# Altium project Artix Express UltraScale v2_2023-02-28T07_25_07_UTC.PrjPcb (part 1 of 7)
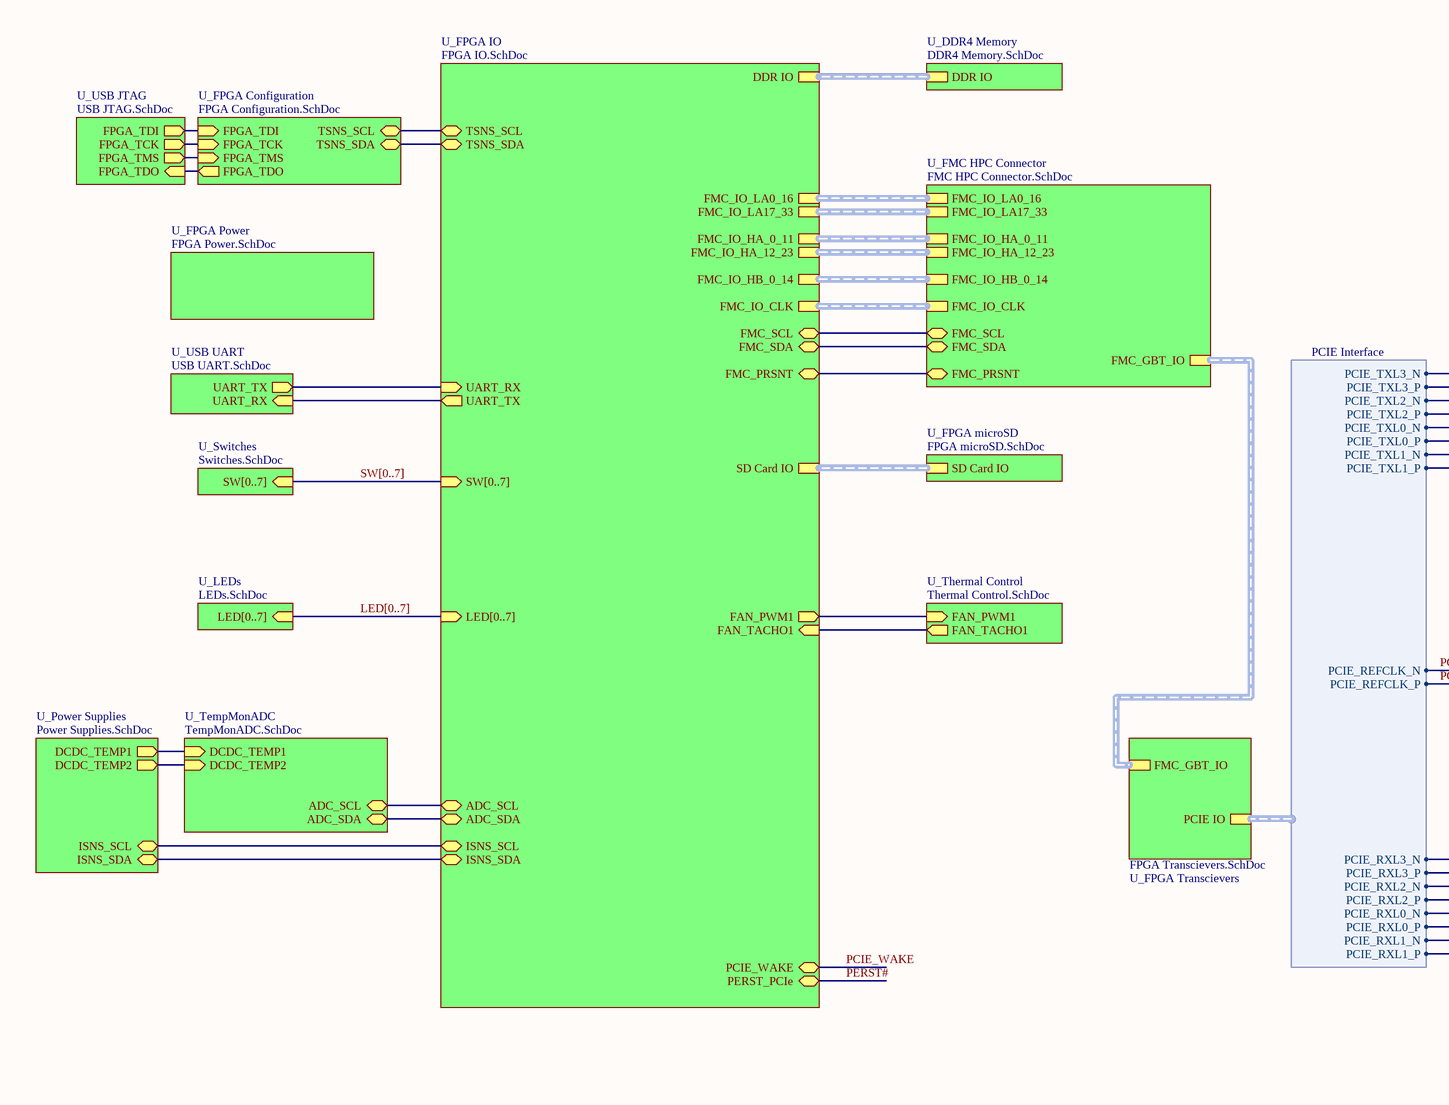
[diagram p0: TopSheet.SchDoc, left]
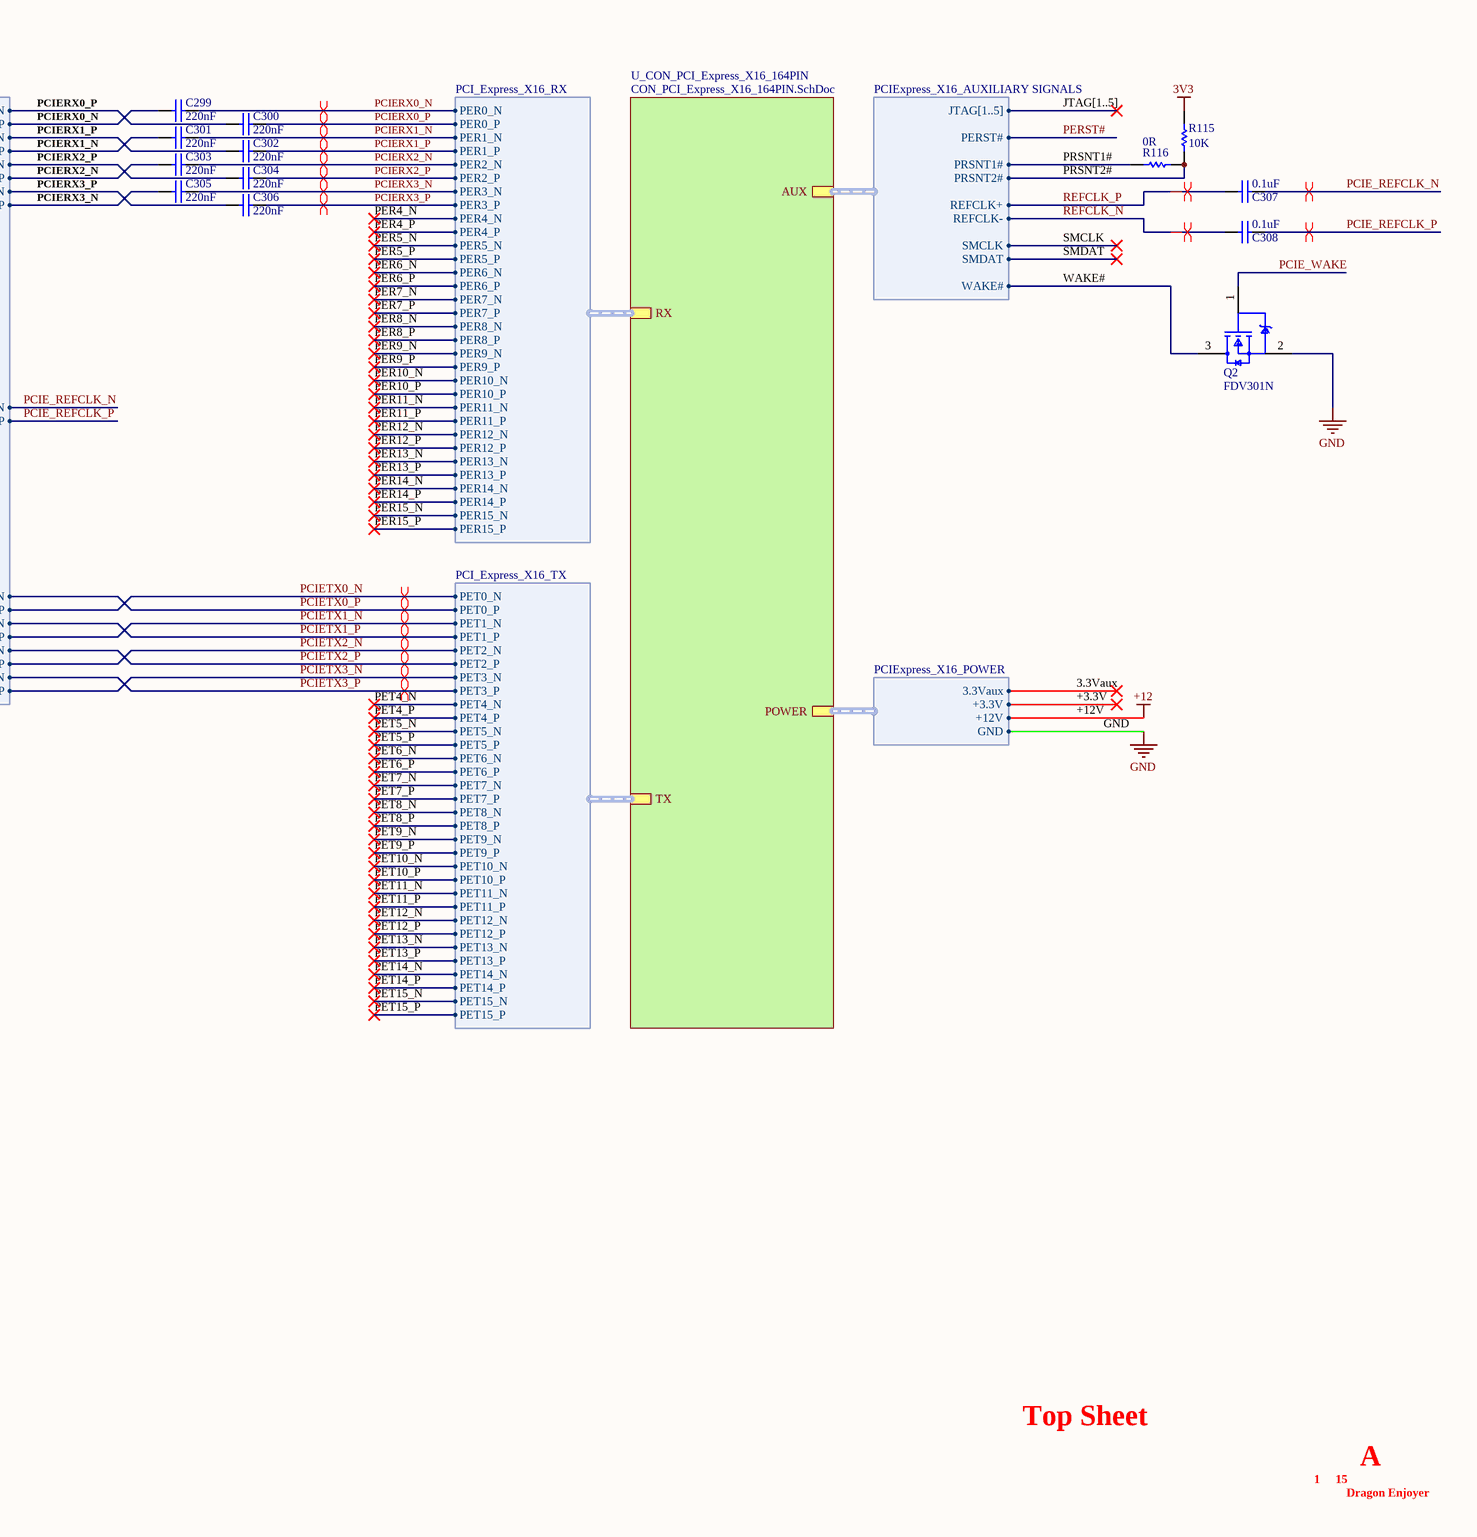
[diagram p1: TopSheet.SchDoc, right]
ProjectAddress1: IBP Shanghai; ProjectAddress2: Level 3 - Building 3; ProjectAddress3: No.168 Linhong Road; ProjectAddress4: Shanghai 200335, China; ProjectOrganization: Altium; ProjectTitle: PCI Express x16 Recommended Length card; Template Family: PCI Express; Template Notes: - Nominal values used, dimensions in mm  - The mounting holes and keep-out areas around them are only required when the I/O bracket is mounted on the card directly  - Component height rule and clearance rule derived from PCI_Express_CEM_r2.0.pdf, Page 84.  - Stackup is not specified in PCI_Express_CEM_r2.0.pdf, nor implemented in this template.; Template Revision Date: Oct 29, 2010; Template Source Document: Outline:PCI_Express_CEM_r2.0.pdf  Pinout:PCI_Express_CEM_r2.0.pdf; Template Source Organization: PCI-SIG; Template Source Revision Date: R2.0, April 11, 2007; Template Source URL: http://www.pcisig.com/
15 sheets, 420 parts. Net scope: hierarchical (ports join the sheet entries above them; power ports are global).
Board file: PCI Express_24130X11115_164PIN.PCBDOC
Sheets:
  TopSheet.SchDoc
    U_DDR4 Memory = DDR4 Memory.SchDoc
    U_FMC HPC Connector = FMC HPC Connector.SchDoc
    U_FPGA Configuration = FPGA Configuration.SchDoc
    U_FPGA IO = FPGA IO.SchDoc
    U_FPGA microSD = FPGA microSD.SchDoc
    U_FPGA Power = FPGA Power.SchDoc
    U_FPGA Transcievers = FPGA Transcievers.SchDoc
    U_LEDs = LEDs.SchDoc
    U_Power Supplies = Power Supplies.SchDoc
    U_Switches = Switches.SchDoc
    U_TempMonADC = TempMonADC.SchDoc
    U_Thermal Control = Thermal Control.SchDoc
    U_USB JTAG = USB JTAG.SchDoc
    U_USB UART = USB UART.SchDoc

## Sheet TopSheet.SchDoc
size A2; SheetNumber: 1; SheetTotal: 16

### Parts
C299  value 220nF  [CAPC1005X56X25LL10T15]  (hidden comment: 04026D224MAT2A)
C300  value 220nF  [CAPC1005X56X25LL10T15]  (hidden comment: 04026D224MAT2A)
C301  value 220nF  [CAPC1005X56X25LL10T15]  (hidden comment: 04026D224MAT2A)
C302  value 220nF  [CAPC1005X56X25LL10T15]  (hidden comment: 04026D224MAT2A)
C303  value 220nF  [CAPC1005X56X25LL10T15]  (hidden comment: 04026D224MAT2A)
C304  value 220nF  [CAPC1005X56X25LL10T15]  (hidden comment: 04026D224MAT2A)
C305  value 220nF  [CAPC1005X56X25LL10T15]  (hidden comment: 04026D224MAT2A)
C306  value 220nF  [CAPC1005X56X25LL10T15]  (hidden comment: 04026D224MAT2A)
C307  value 0.1uF  [CAPC1005X56X25LL10T15]  (hidden comment: 04026D104KAT2A)
C308  value 0.1uF  [CAPC1005X56X25LL10T15]  (hidden comment: 04026D104KAT2A)
Q2  FDV301N  [FP-318-08-MFG]
R115  value 10K  [RESC1609X50X30NL8T20]  (hidden comment: CRCW060310K0FKEA)
R116  value 0R  [RESC1005X40X25ML05T10]  (hidden comment: CRCW04020000Z0EDHP)

### Sub-sheets
U_CON_PCI_Express_X16_164PIN = CON_PCI_Express_X16_164PIN.SchDoc (file not in this document): POWER (harness PCIExpress_X16_POWER), AUX (harness PCIExpress_X16_AUXILIARY SIGNALS), TX (harness PCI_Express_X16_TX), RX (harness PCI_Express_X16_RX)
U_DDR4 Memory = DDR4 Memory.SchDoc: DDR IO (harness DDR IO)
U_FMC HPC Connector = FMC HPC Connector.SchDoc: FMC_GBT_IO (harness FMC_GBT_IO), FMC_IO_LA0_16 (harness FMC_IO_LA0_16), FMC_IO_LA17_33 (harness FMC_IO_LA17_33), FMC_IO_HA_0_11 (harness FMC_IO_HA_0_11), FMC_IO_HA_12_23 (harness FMC_IO_HA_12_23), FMC_SCL (bidir), FMC_SDA (bidir), FMC_PRSNT (bidir), FMC_IO_CLK (harness FMC_IO_CLK), FMC_IO_HB_0_14 (harness FMC_IO_HB_0_14)
U_FPGA Configuration = FPGA Configuration.SchDoc: FPGA_TDI (in), FPGA_TDO (out), FPGA_TCK (in), FPGA_TMS (in), TSNS_SCL (bidir), TSNS_SDA (bidir)
U_FPGA IO = FPGA IO.SchDoc: DDR IO (harness DDR IO), PERST_PCIe (bidir), ISNS_SCL (bidir), ISNS_SDA (bidir), TSNS_SCL (bidir), TSNS_SDA (bidir), FMC_IO_LA0_16 (harness FMC_IO_LA0_16), FMC_IO_LA17_33 (harness FMC_IO_LA17_33), FMC_IO_HA_0_11 (harness FMC_IO_HA_0_11), FMC_IO_HA_12_23 (harness FMC_IO_HA_12_23), FMC_IO_CLK (harness FMC_IO_CLK), UART_TX (out), UART_RX (in), FMC_SCL (bidir), FMC_SDA (bidir), FMC_IO_HB_0_14 (harness FMC_IO_HB_0_14), SD Card IO (harness SD Card IO), LED[0..7] (in), SW[0..7] (in), ADC_SDA (bidir), ADC_SCL (bidir), FMC_PRSNT (bidir), FAN_TACHO1 (in), FAN_PWM1 (out), PCIE_WAKE (bidir)
U_FPGA microSD = FPGA microSD.SchDoc: SD Card IO (harness SD Card IO)
U_FPGA Power = FPGA Power.SchDoc: no entries
U_FPGA Transcievers = FPGA Transcievers.SchDoc: PCIE IO (harness PCIE Interface), FMC_GBT_IO (harness FMC_GBT_IO)
U_LEDs = LEDs.SchDoc: LED[0..7] (in)
U_Power Supplies = Power Supplies.SchDoc: DCDC_TEMP1 (out), DCDC_TEMP2 (out), ISNS_SCL (bidir), ISNS_SDA (bidir)
U_Switches = Switches.SchDoc: SW[0..7] (in)
U_TempMonADC = TempMonADC.SchDoc: DCDC_TEMP1 (in), DCDC_TEMP2 (in), ADC_SDA (bidir), ADC_SCL (bidir)
U_Thermal Control = Thermal Control.SchDoc: FAN_TACHO1 (out), FAN_PWM1 (in)
U_USB JTAG = USB JTAG.SchDoc: FPGA_TDI (out), FPGA_TDO (in), FPGA_TCK (out), FPGA_TMS (out)
U_USB UART = USB UART.SchDoc: UART_TX (out), UART_RX (in)

### Harnesses
PCIE Interface: PCIE_REFCLK_N, PCIE_REFCLK_P, PCIE_RXL0_N, PCIE_RXL0_P, PCIE_RXL1_N, PCIE_RXL1_P, PCIE_RXL2_N, PCIE_RXL2_P, PCIE_RXL3_N, PCIE_RXL3_P, PCIE_TXL0_N, PCIE_TXL0_P, PCIE_TXL1_N, PCIE_TXL1_P, PCIE_TXL2_N, PCIE_TXL2_P, PCIE_TXL3_N, PCIE_TXL3_P
PCI_Express_X16_RX: PER0_N, PER0_P, PER1_N, PER1_P, PER2_N, PER2_P, PER3_N, PER3_P, PER4_N, PER4_P, PER5_N, PER5_P, PER6_N, PER6_P, PER7_N, PER7_P, PER8_N, PER8_P, PER9_N, PER9_P, PER10_N, PER10_P, PER11_N, PER11_P, PER12_N, PER12_P, PER13_N, PER13_P, PER14_N, PER14_P, PER15_N, PER15_P
PCI_Express_X16_TX: PET0_N, PET0_P, PET1_N, PET1_P, PET2_N, PET2_P, PET3_N, PET3_P, PET4_N, PET4_P, PET5_N, PET5_P, PET6_N, PET6_P, PET7_N, PET7_P, PET8_N, PET8_P, PET9_N, PET9_P, PET10_N, PET10_P, PET11_N, PET11_P, PET12_N, PET12_P, PET13_N, PET13_P, PET14_N, PET14_P, PET15_N, PET15_P
PCIExpress_X16_POWER: +3.3V, +12V, GND, 3.3Vaux
PCIExpress_X16_AUXILIARY SIGNALS: JTAG[1..5], PERST#, PRSNT1#, PRSNT2#, REFCLK+, REFCLK-, SMCLK, SMDAT, WAKE#

### Nets
3V3: R115.2  [project net +3V3]
GND: Q2.2(S) ; sheet U_CON_PCI_Express_X16_164PIN/POWER.GND
3.3Vaux: sheet U_CON_PCI_Express_X16_164PIN/POWER.3.3Vaux
+3.3V: sheet U_CON_PCI_Express_X16_164PIN/POWER.+3.3V
FMC_PRSNT: sheet U_FMC HPC Connector/FMC_PRSNT, sheet U_FPGA IO/FMC_PRSNT
FMC_SCL: sheet U_FMC HPC Connector/FMC_SCL, sheet U_FPGA IO/FMC_SCL
FMC_SDA: sheet U_FMC HPC Connector/FMC_SDA, sheet U_FPGA IO/FMC_SDA
FPGA_TCK: sheet U_FPGA Configuration/FPGA_TCK, sheet U_USB JTAG/FPGA_TCK
FPGA_TDI: sheet U_FPGA Configuration/FPGA_TDI, sheet U_USB JTAG/FPGA_TDI
FPGA_TDO: sheet U_FPGA Configuration/FPGA_TDO, sheet U_USB JTAG/FPGA_TDO
FPGA_TMS: sheet U_FPGA Configuration/FPGA_TMS, sheet U_USB JTAG/FPGA_TMS
ISNS_SCL: sheet U_FPGA IO/ISNS_SCL, sheet U_Power Supplies/ISNS_SCL
ISNS_SDA: sheet U_FPGA IO/ISNS_SDA, sheet U_Power Supplies/ISNS_SDA
PCIE_REFCLK_N: C307.2 ; sheet U_FPGA Transcievers/PCIE IO.PCIE_REFCLK_N
PCIE_REFCLK_P: C308.2 ; sheet U_FPGA Transcievers/PCIE IO.PCIE_REFCLK_P
PCIE_TXL0_N: C304.1 ; sheet U_FPGA Transcievers/PCIE IO.PCIE_TXL0_N
PCIE_TXL0_P: C303.1 ; sheet U_FPGA Transcievers/PCIE IO.PCIE_TXL0_P
PCIE_TXL1_N: C306.1 ; sheet U_FPGA Transcievers/PCIE IO.PCIE_TXL1_N
PCIE_TXL1_P: C305.1 ; sheet U_FPGA Transcievers/PCIE IO.PCIE_TXL1_P
PCIE_TXL2_N: C302.1 ; sheet U_FPGA Transcievers/PCIE IO.PCIE_TXL2_N
PCIE_TXL2_P: C301.1 ; sheet U_FPGA Transcievers/PCIE IO.PCIE_TXL2_P
PCIE_TXL3_N: C300.1 ; sheet U_FPGA Transcievers/PCIE IO.PCIE_TXL3_N
PCIE_TXL3_P: C299.1 ; sheet U_FPGA Transcievers/PCIE IO.PCIE_TXL3_P
PCIE_WAKE: Q2.1(G) ; sheet U_FPGA IO/PCIE_WAKE
PCIERX0_N: C299.2 ; sheet U_CON_PCI_Express_X16_164PIN/RX.PER0_N
PCIERX0_P: C300.2 ; sheet U_CON_PCI_Express_X16_164PIN/RX.PER0_P
PCIERX1_N: C301.2 ; sheet U_CON_PCI_Express_X16_164PIN/RX.PER1_N
PCIERX1_P: C302.2 ; sheet U_CON_PCI_Express_X16_164PIN/RX.PER1_P
PCIERX2_N: C303.2 ; sheet U_CON_PCI_Express_X16_164PIN/RX.PER2_N
PCIERX2_P: C304.2 ; sheet U_CON_PCI_Express_X16_164PIN/RX.PER2_P
PCIERX3_N: C305.2 ; sheet U_CON_PCI_Express_X16_164PIN/RX.PER3_N
PCIERX3_P: C306.2 ; sheet U_CON_PCI_Express_X16_164PIN/RX.PER3_P
PCIETX0_N: sheet U_FPGA Transcievers/PCIE IO.PCIE_RXL3_P, sheet U_CON_PCI_Express_X16_164PIN/TX.PET0_N  [project net PCIE_RXL3_P]
PCIETX0_P: sheet U_FPGA Transcievers/PCIE IO.PCIE_RXL3_N, sheet U_CON_PCI_Express_X16_164PIN/TX.PET0_P  [project net PCIE_RXL3_N]
PCIETX1_N: sheet U_FPGA Transcievers/PCIE IO.PCIE_RXL2_P, sheet U_CON_PCI_Express_X16_164PIN/TX.PET1_N  [project net PCIE_RXL2_P]
PCIETX1_P: sheet U_FPGA Transcievers/PCIE IO.PCIE_RXL2_N, sheet U_CON_PCI_Express_X16_164PIN/TX.PET1_P  [project net PCIE_RXL2_N]
PCIETX2_N: sheet U_FPGA Transcievers/PCIE IO.PCIE_RXL0_P, sheet U_CON_PCI_Express_X16_164PIN/TX.PET2_N  [project net PCIE_RXL0_P]
PCIETX2_P: sheet U_FPGA Transcievers/PCIE IO.PCIE_RXL0_N, sheet U_CON_PCI_Express_X16_164PIN/TX.PET2_P  [project net PCIE_RXL0_N]
PCIETX3_N: sheet U_FPGA Transcievers/PCIE IO.PCIE_RXL1_P, sheet U_CON_PCI_Express_X16_164PIN/TX.PET3_N  [project net PCIE_RXL1_P]
PCIETX3_P: sheet U_FPGA Transcievers/PCIE IO.PCIE_RXL1_N, sheet U_CON_PCI_Express_X16_164PIN/TX.PET3_P  [project net PCIE_RXL1_N]
PER4_N: sheet U_CON_PCI_Express_X16_164PIN/RX.PER4_N
PER4_P: sheet U_CON_PCI_Express_X16_164PIN/RX.PER4_P
PER5_N: sheet U_CON_PCI_Express_X16_164PIN/RX.PER5_N
PER5_P: sheet U_CON_PCI_Express_X16_164PIN/RX.PER5_P
PER6_N: sheet U_CON_PCI_Express_X16_164PIN/RX.PER6_N
PER6_P: sheet U_CON_PCI_Express_X16_164PIN/RX.PER6_P
PER7_N: sheet U_CON_PCI_Express_X16_164PIN/RX.PER7_N
PER7_P: sheet U_CON_PCI_Express_X16_164PIN/RX.PER7_P
PER8_N: sheet U_CON_PCI_Express_X16_164PIN/RX.PER8_N
PER8_P: sheet U_CON_PCI_Express_X16_164PIN/RX.PER8_P
PER9_N: sheet U_CON_PCI_Express_X16_164PIN/RX.PER9_N
PER9_P: sheet U_CON_PCI_Express_X16_164PIN/RX.PER9_P
PER10_N: sheet U_CON_PCI_Express_X16_164PIN/RX.PER10_N
PER10_P: sheet U_CON_PCI_Express_X16_164PIN/RX.PER10_P
PER11_N: sheet U_CON_PCI_Express_X16_164PIN/RX.PER11_N
PER11_P: sheet U_CON_PCI_Express_X16_164PIN/RX.PER11_P
PER12_N: sheet U_CON_PCI_Express_X16_164PIN/RX.PER12_N
PER12_P: sheet U_CON_PCI_Express_X16_164PIN/RX.PER12_P
PER13_N: sheet U_CON_PCI_Express_X16_164PIN/RX.PER13_N
PER13_P: sheet U_CON_PCI_Express_X16_164PIN/RX.PER13_P
PER14_N: sheet U_CON_PCI_Express_X16_164PIN/RX.PER14_N
PER14_P: sheet U_CON_PCI_Express_X16_164PIN/RX.PER14_P
PER15_N: sheet U_CON_PCI_Express_X16_164PIN/RX.PER15_N
PER15_P: sheet U_CON_PCI_Express_X16_164PIN/RX.PER15_P
PERST#: sheet U_FPGA IO/PERST_PCIe, sheet U_CON_PCI_Express_X16_164PIN/AUX.PERST#
PET4_N: sheet U_CON_PCI_Express_X16_164PIN/TX.PET4_N
PET4_P: sheet U_CON_PCI_Express_X16_164PIN/TX.PET4_P
PET5_N: sheet U_CON_PCI_Express_X16_164PIN/TX.PET5_N
PET5_P: sheet U_CON_PCI_Express_X16_164PIN/TX.PET5_P
PET6_N: sheet U_CON_PCI_Express_X16_164PIN/TX.PET6_N
PET6_P: sheet U_CON_PCI_Express_X16_164PIN/TX.PET6_P
PET7_N: sheet U_CON_PCI_Express_X16_164PIN/TX.PET7_N
PET7_P: sheet U_CON_PCI_Express_X16_164PIN/TX.PET7_P
PET8_N: sheet U_CON_PCI_Express_X16_164PIN/TX.PET8_N
PET8_P: sheet U_CON_PCI_Express_X16_164PIN/TX.PET8_P
PET9_N: sheet U_CON_PCI_Express_X16_164PIN/TX.PET9_N
PET9_P: sheet U_CON_PCI_Express_X16_164PIN/TX.PET9_P
PET10_N: sheet U_CON_PCI_Express_X16_164PIN/TX.PET10_N
PET10_P: sheet U_CON_PCI_Express_X16_164PIN/TX.PET10_P
PET11_N: sheet U_CON_PCI_Express_X16_164PIN/TX.PET11_N
PET11_P: sheet U_CON_PCI_Express_X16_164PIN/TX.PET11_P
PET12_N: sheet U_CON_PCI_Express_X16_164PIN/TX.PET12_N
PET12_P: sheet U_CON_PCI_Express_X16_164PIN/TX.PET12_P
PET13_N: sheet U_CON_PCI_Express_X16_164PIN/TX.PET13_N
PET13_P: sheet U_CON_PCI_Express_X16_164PIN/TX.PET13_P
PET14_N: sheet U_CON_PCI_Express_X16_164PIN/TX.PET14_N
PET14_P: sheet U_CON_PCI_Express_X16_164PIN/TX.PET14_P
PET15_N: sheet U_CON_PCI_Express_X16_164PIN/TX.PET15_N
PET15_P: sheet U_CON_PCI_Express_X16_164PIN/TX.PET15_P
PRSNT1#: R116.1 ; sheet U_CON_PCI_Express_X16_164PIN/AUX.PRSNT1#
PRSNT2#: R115.1 R116.2 ; sheet U_CON_PCI_Express_X16_164PIN/AUX.PRSNT2#
REFCLK_N: C308.1 ; sheet U_CON_PCI_Express_X16_164PIN/AUX.REFCLK-
REFCLK_P: C307.1 ; sheet U_CON_PCI_Express_X16_164PIN/AUX.REFCLK+
SMCLK: sheet U_CON_PCI_Express_X16_164PIN/AUX.SMCLK
SMDAT: sheet U_CON_PCI_Express_X16_164PIN/AUX.SMDAT
TSNS_SCL: sheet U_FPGA Configuration/TSNS_SCL, sheet U_FPGA IO/TSNS_SCL
TSNS_SDA: sheet U_FPGA Configuration/TSNS_SDA, sheet U_FPGA IO/TSNS_SDA
UART_RX: sheet U_FPGA IO/UART_TX, sheet U_USB UART/UART_RX
UART_TX: sheet U_FPGA IO/UART_RX, sheet U_USB UART/UART_TX
WAKE#: Q2.3(D) ; sheet U_CON_PCI_Express_X16_164PIN/AUX.WAKE#
NetR83_2: sheet U_FPGA IO/ADC_SDA, sheet U_TempMonADC/ADC_SDA
NetR84_2: sheet U_FPGA IO/ADC_SCL, sheet U_TempMonADC/ADC_SCL
NetU1_F3: sheet U_Power Supplies/DCDC_TEMP2, sheet U_TempMonADC/DCDC_TEMP2
NetU2_F3: sheet U_Power Supplies/DCDC_TEMP1, sheet U_TempMonADC/DCDC_TEMP1
NetU12_W12: sheet U_FPGA IO/FAN_TACHO1, sheet U_Thermal Control/FAN_TACHO1
NetU12_W13: sheet U_FPGA IO/FAN_PWM1, sheet U_Thermal Control/FAN_PWM1

### Buses and harness runs
bus JTAG[1..5]
bus LED[0..7] = sheet U_FPGA IO/LED[0..7] = sheet U_LEDs/LED[0..7]
bus SW[0..7] = sheet U_FPGA IO/SW[0..7] = sheet U_Switches/SW[0..7]
harness sheet U_DDR4 Memory/DDR IO = sheet U_FPGA IO/DDR IO
harness sheet U_FMC HPC Connector/FMC_GBT_IO = sheet U_FPGA Transcievers/FMC_GBT_IO
harness sheet U_FMC HPC Connector/FMC_IO_CLK = sheet U_FPGA IO/FMC_IO_CLK
harness sheet U_FMC HPC Connector/FMC_IO_HA_0_11 = sheet U_FPGA IO/FMC_IO_HA_0_11
harness sheet U_FMC HPC Connector/FMC_IO_HA_12_23 = sheet U_FPGA IO/FMC_IO_HA_12_23
harness sheet U_FMC HPC Connector/FMC_IO_HB_0_14 = sheet U_FPGA IO/FMC_IO_HB_0_14
harness sheet U_FMC HPC Connector/FMC_IO_LA0_16 = sheet U_FPGA IO/FMC_IO_LA0_16
harness sheet U_FMC HPC Connector/FMC_IO_LA17_33 = sheet U_FPGA IO/FMC_IO_LA17_33
harness sheet U_FPGA IO/SD Card IO = sheet U_FPGA microSD/SD Card IO

### Layout directives
differential pair: PCIE_REFCLK_N, PCIE_REFCLK_P, PCIE_RXL0_N, PCIE_RXL0_P, PCIE_RXL1_N, PCIE_RXL1_P, PCIE_RXL2_N, PCIE_RXL2_P, PCIE_RXL3_N, PCIE_RXL3_P, PCIERX0_N, PCIERX0_P, PCIERX1_N, PCIERX1_P, PCIERX2_N, PCIERX2_P, PCIERX3_N, PCIERX3_P, REFCLK_N, REFCLK_P

### Notes on the sheet
- PCIERX0_N
- PCIERX0_P
- PCIERX1_N
- PCIERX1_P
- PCIERX2_N
- PCIERX2_P
- PCIERX3_N
- PCIERX3_P
- Top Sheet
- 1
- 15
- Dragon Enjoyer
- A

### Library data of the parts
C299-C306 = CMP-2008-02749-1: Manufacturer: AVX Interconnect / Elco; Part Number: 04026D224MAT2A
C307 C308 = CMP-2008-02743-1: Manufacturer: AVX Interconnect / Elco; Part Number: 04026D104KAT2A
Q2 = CMP-2000-04935-2: MOSFET N-CH 25V 220MA SOT-23; Manufacturer: ON Semiconductor; Turn Off Delay Time: 3.5ns; Typ Forward Diode Voltage: 0.8V; Max Junction Temp: +150°C; Threshold Vgs Max: 1.06V; Threshold Vgs Min: 0.7V; Standoff Height: 0.01mm; Max Forward Diode Voltage: 1.2V; Number Of Channels: 1; Rthja Max: 357°C/W; Drain To Source Resistance: 3.1Ω; Input Capacitace At Vds: 9.5pF @ 10V; Gate Charge At Vgs: 0.49nC @ 4.5V; Transconductance: 0.2S; Turn On Delay Time: 3.2ns; Depletion Mode: False; Power Dissipation: 0.35W; Continuous Drain Current: 0.22A; Gate To Source Voltage: 8V; RoHS: TRUE; Lead Free: Yes; Temperature Range High: +150°C; Automotive: No; Height: 1.11mm; Category: Trans; Mouser Description: MOSFET N-Ch Digital; Drain To Source Voltage: 25V; Temperature: -55°C to +150°C; Ipc Land Pattern Name: SOT95P240X100-3; Device Class L1: Discrete Semiconductors; Octopart: https://octopart.com/fdv301n-on+semiconductor-84326713; Footprint Url: https://www.onsemi.com/pub/Collateral/318-08.PDF; Digikey Description: MOSFET N-CH 25V 220MA SOT-23; Drain To Source Breakdown Voltage: 25V; Temperature Range Low: -55°C; Number Of N Channels: 1; Device Class L3: MOSFETs; Package: 318-08; ComponentLink2URL: https://www.onsemi.com/pub/Collateral/FDV301N-D.PDF; Manufacturer Part Number: FDV301N; Device Class L2: Transistors; ComponentLink2Description: Datasheet
R115 = CMP-1666-00005-4: Chip Resistor, 10 KOhm, +/- 1%, 100 mW, -55 to 155 degC, 0603 (1608 Metric), RoHS, Tape and Reel; Manufacturer: Vishay Semiconductor; Voltage Rating: 75 V; Max Operating Temperature: 155 degC; PackageDescription: 2-Pin Surface Mount Device, Body 1.575 x 0.85 mm; ComponentLink1Description: Manufacturer URL; RoHSCompliant: true; PackageReference: 0603; REACH SVHC: Unknown; Length: 1.55 mm; DatasheetVersion: 06/2012; Packaging: Tape and Reel; Min Operating Temperature: -55 degC; Mounting Technology: Surface Mount; ComponentLink2URL: https://datasheet.ciiva.com/11809/0900766b80d98afc-11809037.pdf; Height: 0.45 mm; ComponentLink2Description: Datasheet; Package Quantity: 5000; ComponentLink1URL: http://www.vishay.com/
R116 = CMP-2002-03041-1: Manufacturer: Vishay Dale; Part Number: CRCW04020000Z0EDHP

## Sheet DDR4 Memory.SchDoc
size A3; SheetNumber: 7; SheetTotal: 16
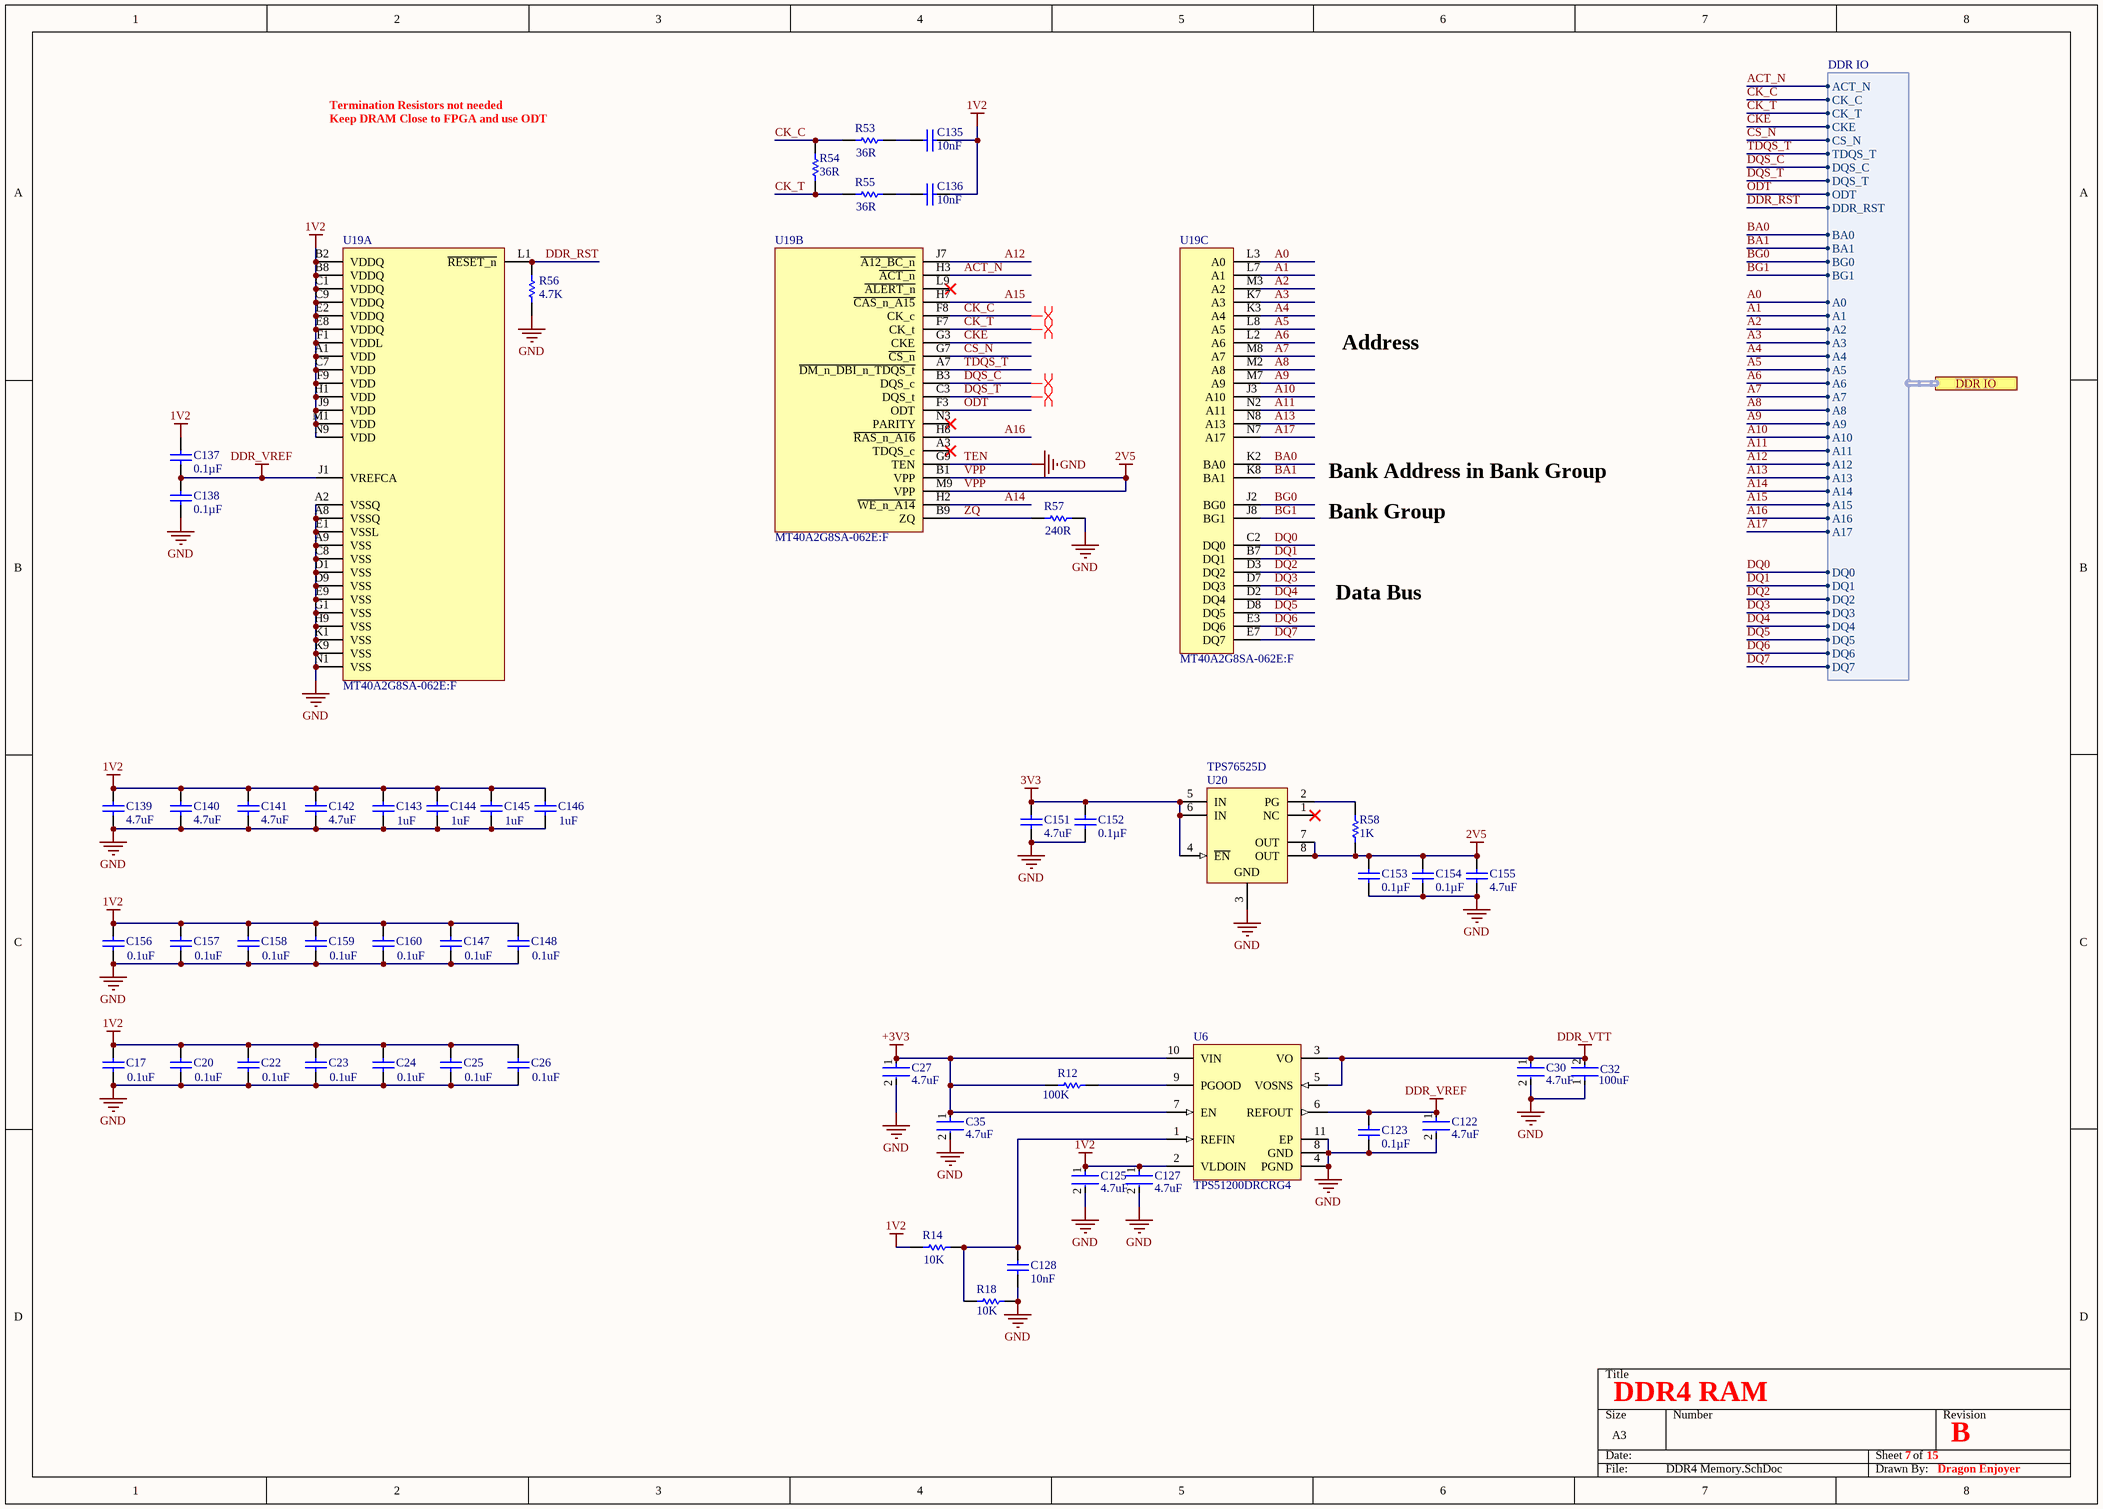
[diagram p2: DDR4 Memory.SchDoc]

### Parts
C17  value 0.1uF  [CAPC0603X33X15LL03T05]  (hidden comment: 02016D104KAT2A)
C20  value 0.1uF  [CAPC0603X33X15LL03T05]  (hidden comment: 02016D104KAT2A)
C22  value 0.1uF  [CAPC0603X33X15LL03T05]  (hidden comment: 02016D104KAT2A)
C23  value 0.1uF  [CAPC0603X33X15LL03T05]  (hidden comment: 02016D104KAT2A)
C24  value 0.1uF  [CAPC0603X33X15LL03T05]  (hidden comment: 02016D104KAT2A)
C25  value 0.1uF  [CAPC0603X33X15LL03T05]  (hidden comment: 02016D104KAT2A)
C26  value 0.1uF  [CAPC0603X33X15LL03T05]  (hidden comment: 02016D104KAT2A)
C27  Capacitance: 4.7uF  [FP-C1005-050-0_15-MFG]  (hidden comment: C1005X5R1A475K050BC)
C30  Capacitance: 4.7uF  [FP-C1005-050-0_15-MFG]  (hidden comment: C1005X5R1A475K050BC)
C32  Capacitance: 100uF  [FP-GRM21B-0_2-e0_2_0_7-IPC_C]  (hidden comment: GRM21BC80G107ME15L)
C35  Capacitance: 4.7uF  [FP-C1005-050-0_15-MFG]  (hidden comment: C1005X5R1A475K050BC)
C122  Capacitance: 4.7uF  [FP-C1005-050-0_15-MFG]  (hidden comment: C1005X5R1A475K050BC)
C123  Capacitance: 0.1µF  [CAPC1005X55X25LL05T05]  (hidden comment: CC0402ZRY5V8BB104)
C125  Capacitance: 4.7uF  [FP-C1005-050-0_15-MFG]  (hidden comment: C1005X5R1A475K050BC)
C127  Capacitance: 4.7uF  [FP-C1005-050-0_15-MFG]  (hidden comment: C1005X5R1A475K050BC)
C128  Capacitance: 10nF  [CAPC1608X90X35ML10T15]  (hidden comment: GRM188R71H103KA01D)
C135  value 10nF  [CAPC1005X55X25LL05T10]  (hidden comment: GRM155R71E103KA01D)
C136  value 10nF  [CAPC1005X55X25LL05T10]  (hidden comment: GRM155R71E103KA01D)
C137  Capacitance: 0.1µF  [CAPC1005X55X25LL05T05]  (hidden comment: CC0402ZRY5V8BB104)
C138  Capacitance: 0.1µF  [CAPC1005X55X25LL05T05]  (hidden comment: CC0402ZRY5V8BB104)
C139  value 4.7uF  [CAPC2013X135X45NL10T25]  (hidden comment: GRM21BR61E475KA12L)
C140  value 4.7uF  [CAPC2013X135X45NL10T25]  (hidden comment: GRM21BR61E475KA12L)
C141  value 4.7uF  [CAPC2013X135X45NL10T25]  (hidden comment: GRM21BR61E475KA12L)
C142  value 4.7uF  [CAPC2013X135X45NL10T25]  (hidden comment: GRM21BR61E475KA12L)
C143  value 1uF  [CAPC0402(1005)60_L]  (hidden comment: CAP 1uF 6.3V 0402(1005))
C144  value 1uF  [CAPC0402(1005)60_L]  (hidden comment: CAP 1uF 6.3V 0402(1005))
C145  value 1uF  [CAPC0402(1005)60_L]  (hidden comment: CAP 1uF 6.3V 0402(1005))
C146  value 1uF  [CAPC0402(1005)60_L]  (hidden comment: CAP 1uF 6.3V 0402(1005))
C147  value 0.1uF  [CAPC0603X33X15LL03T05]  (hidden comment: 02016D104KAT2A)
C148  value 0.1uF  [CAPC0603X33X15LL03T05]  (hidden comment: 02016D104KAT2A)
C151  value 4.7uF  [CAPC2013X135X45NL10T25]  (hidden comment: GRM21BR61E475KA12L)
C152  Capacitance: 0.1µF  [CAPC1005X55X25LL05T05]  (hidden comment: CC0402ZRY5V8BB104)
C153  Capacitance: 0.1µF  [CAPC1005X55X25LL05T05]  (hidden comment: CC0402ZRY5V8BB104)
C154  Capacitance: 0.1µF  [CAPC1005X55X25LL05T05]  (hidden comment: CC0402ZRY5V8BB104)
C155  value 4.7uF  [CAPC2013X135X45NL10T25]  (hidden comment: GRM21BR61E475KA12L)
C156  value 0.1uF  [CAPC0603X33X15LL03T05]  (hidden comment: 02016D104KAT2A)
C157  value 0.1uF  [CAPC0603X33X15LL03T05]  (hidden comment: 02016D104KAT2A)
C158  value 0.1uF  [CAPC0603X33X15LL03T05]  (hidden comment: 02016D104KAT2A)
C159  value 0.1uF  [CAPC0603X33X15LL03T05]  (hidden comment: 02016D104KAT2A)
C160  value 0.1uF  [CAPC0603X33X15LL03T05]  (hidden comment: 02016D104KAT2A)
R12  value 100K  [RESC1005X40X25LL05T05]  (hidden comment: CRCW0402100KJNED)
R14  value 10K  [RESC1005X40X25LL05T10]  (hidden comment: RC0402FR-0710KL)
R18  value 10K  [RESC1005X40X25LL05T10]  (hidden comment: RC0402FR-0710KL)
R53  value 36R  [RESC1005X40X25ML05T05]  (hidden comment: CRCW040236R0FKED)
R54  value 36R  [RESC1005X40X25ML05T05]  (hidden comment: CRCW040236R0FKED)
R55  value 36R  [RESC1005X40X25ML05T05]  (hidden comment: CRCW040236R0FKED)
R56  value 4.7K  [RESC1005X40X25LL05T10]  (hidden comment: RC0402JR-074K7L)
R57  value 240R  [RESC1005X40X25ML05T05]  (hidden comment: CRCW0402240RFKED)
R58  value 1K  [RESC1005X40X25NL05T10]  (hidden comment: RC0402FR-071KL)
U6  TPS51200DRCRG4  [TI-DRC10-2400X1650TP_V]
U19  MT40A2G8SA-062E:F  [BGA78C80P6X13_750X1100X110]  (parts A,B,C of 3)
U20  TPS76525D  [D0008A_N]

### Ports
DDR IO (harness DDR IO)

### Harnesses
DDR IO: ACT_N, CK_C, CK_T, CKE, CS_N, TDQS_T, DQS_C, DQS_T, ODT, BA0, BA1, BG0, BG1, A0, A1, A2, A3, A4, A5, A6, A7, A8, A9, A10, A11, A12, A13, A14, A15, A16, A17, DQ0, DQ1, DQ2, DQ3, DQ4, DQ5, DQ6, DQ7, DDR_RST

### Nets
1V2: C17.2 C20.2 C22.2 C23.2 C24.2 C25.2 C26.2 C125.1 C127.1 C135.2 C136.2 C137.2 C139.1 C140.1 C141.1 C142.1 C143.2 C144.2 C145.2 C146.2 C147.2 C148.2 C156.2 C157.2 C158.2 C159.2 C160.2 R14.1 U6.2(VLDOIN) U19.A1(VDD) U19.B2(VDDQ) U19.B8(VDDQ) U19.C1(VDDQ) U19.C7(VDD) U19.C9(VDDQ) U19.E2(VDDQ) U19.E8(VDDQ) U19.F1(VDDL) U19.F9(VDD) U19.H1(VDD) U19.J9(VDD) U19.M1(VDD) U19.N9(VDD)
2V5: C153.2 C154.2 C155.1 R58.1 U19.B1(VPP) U19.M9(VPP) U20.7(OUT) U20.8(OUT)  [also labelled VPP]
+3V3: C27.1 C35.1 C151.1 C152.2 R12.1 U6.7(EN) U6.10(VIN) U20.4(~{EN}) U20.5(IN) U20.6(IN)  [also labelled 3V3]
DDR_VREF: C122.1 C123.2 C137.1 C138.2 U6.6(REFOUT) U19.J1(VREFCA)
DDR_VTT: C30.1 C32.2 U6.3(VO) U6.5(VOSNS)
GND: C17.1 C20.1 C22.1 C23.1 C24.1 C25.1 C26.1 C27.2 C30.2 C32.1 C35.2 C122.2 C123.1 C125.2 C127.2 C128.2 C138.1 C139.2 C140.2 C141.2 C142.2 C143.1 C144.1 C145.1 C146.1 C147.1 C148.1 C151.2 C152.1 C153.1 C154.1 C155.2 C156.1 C157.1 C158.1 C159.1 C160.1 R18.1 R56.1 R57.2 U6.4(PGND) U6.8(GND) U6.11(EP) U19.A2(VSSQ) U19.A8(VSSQ) U19.A9(VSS) U19.C8(VSS) U19.D1(VSS) U19.D9(VSS) U19.E1(VSSL) U19.E9(VSS) U19.G1(VSS) U19.G9(TEN) U19.H9(VSS) U19.K1(VSS) U19.K9(VSS) U19.N1(VSS) U20.3(GND)  [also labelled TEN]
A0: U19.L3(A0) ; port DDR IO.A0
A1: U19.L7(A1) ; port DDR IO.A1
A2: U19.M3(A2) ; port DDR IO.A2
A3: U19.K7(A3) ; port DDR IO.A3
A4: U19.K3(A4) ; port DDR IO.A4
A5: U19.L8(A5) ; port DDR IO.A5
A6: U19.L2(A6) ; port DDR IO.A6
A7: U19.M8(A7) ; port DDR IO.A7
A8: U19.M2(A8) ; port DDR IO.A8
A9: U19.M7(A9) ; port DDR IO.A9
A10: U19.J3(A10) ; port DDR IO.A10
A11: U19.N2(A11) ; port DDR IO.A11
A12: U19.J7(~{A12_BC_n}) ; port DDR IO.A12
A13: U19.N8(A13) ; port DDR IO.A13
A14: U19.H2(~{WE_n_A14}) ; port DDR IO.A14
A15: U19.H7(~{CAS_n_A15}) ; port DDR IO.A15
A16: U19.H8(~{RAS_n_A16}) ; port DDR IO.A16
A17: U19.N7(A17) ; port DDR IO.A17
ACT_N: U19.H3(~{ACT_n}) ; port DDR IO.ACT_N
BA0: U19.K2(BA0) ; port DDR IO.BA0
BA1: U19.K8(BA1) ; port DDR IO.BA1
BG0: U19.J2(BG0) ; port DDR IO.BG0
BG1: U19.J8(BG1) ; port DDR IO.BG1
CK_C: R53.1 R54.2 U19.F8(CK_c) ; port DDR IO.CK_C
CK_T: R54.1 R55.1 U19.F7(CK_t) ; port DDR IO.CK_T
CKE: U19.G3(CKE) ; port DDR IO.CKE
CS_N: U19.G7(~{CS_n}) ; port DDR IO.CS_N
DDR_RST: R56.2 U19.L1(~{RESET_n}) ; port DDR IO.DDR_RST
DQ0: U19.C2(DQ0) ; port DDR IO.DQ0
DQ1: U19.B7(DQ1) ; port DDR IO.DQ1
DQ2: U19.D3(DQ2) ; port DDR IO.DQ2
DQ3: U19.D7(DQ3) ; port DDR IO.DQ3
DQ4: U19.D2(DQ4) ; port DDR IO.DQ4
DQ5: U19.D8(DQ5) ; port DDR IO.DQ5
DQ6: U19.E3(DQ6) ; port DDR IO.DQ6
DQ7: U19.E7(DQ7) ; port DDR IO.DQ7
DQS_C: U19.B3(DQS_c) ; port DDR IO.DQS_C
DQS_T: U19.C3(DQS_t) ; port DDR IO.DQS_T
ODT: U19.F3(ODT) ; port DDR IO.ODT
TDQS_T: U19.A7(~{DM_n_DBI_n_TDQS_t}) ; port DDR IO.TDQS_T
ZQ: R57.1 U19.B9(ZQ)
NetC128_1: C128.1 R14.2 R18.2 U6.1(REFIN)
NetC135_1: C135.1 R53.2
NetC136_1: C136.1 R55.2
NetR12_2: R12.2 U6.9(PGOOD)
NetR58_2: R58.2 U20.2(PG)

Not connected (* = marked no-connect by the designer): U19 A3(TDQS_c)* L9(~{ALERT_n})* N3(PARITY)*; U20 1(NC)*

### Layout directives
differential pair: CK_C, CK_T, DQS_C, DQS_T

### Notes on the sheet
- Termination Resistors not needed
- Keep DRAM Close to FPGA and use ODT
- Address
- Bank Address in Bank Group
- Bank Group
- Data Bus
- DDR4 RAM
- 7
- 15
- B
- Dragon Enjoyer

### Library data of the parts
C17 C20 C22-C26 C147 C148 C156-C160 = CMP-2010-00159-1: Manufacturer: AVX Interconnect / Elco; Part Number: 02016D104KAT2A
C27 C30 C35 C122 C125 C127 = CMP-2000-05997-2: CAP CER 4.7UF 10V X5R 0402; Dielectric Material: Ceramic; Tolerance: 10%; Series: C; Package Quantity: 10000; Max Operating Temperature: 85°C; Case Code (Imperial): 0402; Lead Free: Lead Free; Voltage Rating (DC): 10V; Packaging: Cut Tape; Voltage Rating: 10V; Min Operating Temperature: -55°C; Dielectric: X5R; Thickness: 0.022inch; Width: 0.02inch; Case/Package: 0402; Case Code (Metric): 1005; Length: 0.039inch; RoHS Compliant: Yes; REACH SVHC: No SVHC; Mount: Surface Mount
C32 = CMP-06035-010229-1: Chip Multilayer Ceramic Capacitors for General Purpose, 0805, 100uF, X6S, 22%, 20%, 4V; Case/Package: 0805; Packaging: Cut Tape; REACH SVHC: No SVHC; Min Operating Temperature: -55°C; Length: 0.079inch; Max Operating Temperature: 105°C; Case Code (Imperial): 0805; Width: 0.049inch; Case Code (Metric): 2012; Tolerance: 20%; Voltage Rating: 4V; Mount: Surface Mount; Voltage Rating (DC): 4V; Thickness: 0.057inch; Dielectric: X6S
C123 C137 C138 C152-C154 = CMP-2000-06071-1: Chip Capacitor, 100 nF, -20% to 80%, 25 V, -30 to 85 degC, 0402 (1005 Metric), RoHS, Tape and Reel; Manufacturer: Yageo; Online Catalog: CCSeries; Tolerance: -20%,+80%; Voltage - Rated: 25V; Product Training Modules: MultilayerCeramicCapacitors; Catalog Drawings: CC_0402; Other Names: 311-1375-6; Temperature Coefficient: Y5V(F); Datasheet URL: http://www.farnell.com/datasheets/1132289.pdf; Features: -; Package Description: 2-Pin Surface Mount Device, Body 1 x 0.5 mm; Standard Package: 1; Mounting Technology: SurfaceMount; Lead Style: -; Thickness (Max): 0.022"(0.55mm); Family: CeramicCapacitors; Series: CC; Applications: GeneralPurpose; Lead Spacing: -; Size / Dimension: 0.039"Lx0.020"W(1.00mmx0.50mm); Manufacturer URL: http://www.yageo.com/; Category: Capacitors; Datasheet Version: Rev. 5, 07/2010; Height - Seated (Max): -; Packaging: Digi-Reel®; Operating Temperature: -30°C~85°C; Mounting Type: SurfaceMount,MLCC; Package Reference: 0402; Ratings: -; Package / Case: 0402(1005Metric)
C128 = CMP-2100-03642-1: Chip Capacitor, 10 nF, +/- 10%, 50 V, -55 to 125 degC, 0603 (1608 Metric), RoHS, Tape and Reel; Manufacturer: Murata; Insulation Resistance: 10GR; Dielectric: X7R; Voltage Rating: 50V; Material: Ceramic; Package Quantity: 1; Lead Free: LeadFree; Case/Package: 0603; Termination: SMD/SMT; REACH SVHC: Unknown; Manufacturer URL: http://www.murata.com/; Datasheet URL: http://search.murata.co.jp/Ceramy/image/img/A01X/G101/ENG/GRM188R71H103KA01-01.pdf; Mount: SurfaceMount; Datasheet Version: 42401.0; Number of Pins: 2; Length: 1.6mm; Voltage: 50V; Depth: 0.8mm; Tolerance: 10%; Min Operating Temperature: -55degC; Voltage Rating (DC): 50V; Max Operating Temperature: 125degC; Package Description: 2-Pin Surface Mount Device, Body 1.6 x 0.8 mm; RoHSCompliant: True; Case Code (Imperial): 0603; Width: 0.031inch; Case Code (Metric): 1608; Height: 0.8mm; Package Reference: 0603; Packaging: TapeandReel; Thickness: 0.035inch; Dielectric Material: Ceramic
C135 C136 = CMP-1034-01880-2: Manufacturer: Murata; Part Number: GRM155R71E103KA01D
C139-C142 C151 C155 = CMP-2007-03545-1: Manufacturer: Murata; Part Number: GRM21BR61E475KA12L
C143-C146 = CMP-1034-02115-1: CAP 1uF 6.3V -20% to +80% 0402 (1005 Metric) Thickness 0.6mm SMD; Case-EIA: 0402; Case-Metric: 1005; Rated Voltage: 6.3 V; Tolerance: -20% to +80%; Technology: SMT; Max Thickness: 0.6 mm
R12 = CMP-2002-08125-1: Manufacturer: Vishay Dale; Part Number: CRCW0402100KJNED
R14 R18 = CMP-2002-07353-1: Manufacturer: Yageo / Phycomp; Part Number: RC0402FR-0710KL
R53-R55 = CMP-2002-00305-1: Manufacturer: Vishay Dale; Part Number: CRCW040236R0FKED
R56 = CMP-2002-08011-1: Manufacturer: Yageo / Phycomp; Part Number: RC0402JR-074K7L
R57 = CMP-2002-08397-1: Manufacturer: Vishay Dale; Part Number: CRCW0402240RFKED
R58 = CMP-2002-07472-1: Manufacturer: Yageo / Phycomp; Part Number: RC0402FR-071KL
U6 = CMP-0395-00657-1: Single Output LDO, 3 A, 2.375 to 3.5 V Input, with DDR Termination, 10-pin SON (DRC), -40 to 85 degC, Green (RoHS & no Sb/Br); Manufacturer: Texas Instruments; Iq(Typ)(mA): 0.5; Power Good: TRUE; SubFamily: Single Channel LDO; Iout(Max)(A): 3; Vin(Max)(V): 3.5; Rating: Catalog; Vin(Min)(V): 2.3; PackageVersion: 4204102-3/L; ComponentLink2Description: Datasheet; ComponentLink3URL: http://www.ti.com/litv/pdf/mpds117k; ComponentLink1Description: Manufacturer URL; PackageDescription: 10-Pin Plastic Small Outline, Body 3 x 3 mm, Pitch 0.5 mm; ComponentLink1URL: http://www.ti.com/; ComponentLink4URL: Samples URL:http://www.ti.com/product/tps51200#samples; PackageReference: DRC10-2400X1650TP; ComponentLink4Description: URL Link1; ComponentLink3Description: Package Specification; DatasheetVersion: SLUS812; Eco-Plan: Green (RoHS & no Sb/Br); PartNumber: TPS51200DRCRG4; ComponentLink2URL: http://www.ti.com/general/docs/lit/getliterature.tsp?genericPartNumber=TPS51200&fileType=pdf; Mounting Technology: Surface Mount
U19 = CMP-019-00061-1: MICMT40A2G8SA-062E: F DDR4 16G 2GX8 Fbga; PartId: 1
U20 = CMP-0394-00064-2: Single Output LDO, 150 mA, Fixed 2.5 V Output, 2.7 to 10 V Input, with Low IQ, 8-pin SOIC (D), -40 to 125 degC, Green (RoHS & no Sb/Br); Manufacturer: Texas Instruments; Vdo(Typ)(mV): 85; Iq(Typ)(mA): 0.03; Rating: Catalog; Vin(Max)(V): 10; Vin(Min)(V): 2.7; Power Good: TRUE; Iout(Max)(A): 0.15; Vout Adj(Min)(V): 2.5; SubFamily: Single Channel LDO; ComponentLink4URL: Samples URL:http://www.ti.com/product/tps76525#samples; ComponentLink3Description: Package Specification; ComponentLink1Description: Manufacturer URL; ComponentLink3URL: http://www.ti.com/litv/pdf/msoi002j; PackageReference: D0008A; ComponentLink1URL: http://www.ti.com/; Eco-Plan: Green (RoHS & no Sb/Br); PackageVersion: 4040047-3/M; ComponentLink2URL: http://www.ti.com/general/docs/lit/getliterature.tsp?genericPartNumber=TPS76525&fileType=pdf; ComponentLink4Description: URL Link1; Code_JEDEC: MS-012; DatasheetVersion: SLVS236; PackageDescription: 8-Pin Plastic Small Outline, Body 4.9 x 3.9 mm, Pitch 1.27 mm; Mounting Technology: Surface Mount; ComponentLink2Description: Datasheet; PartNumber: TPS76525D; Fixed Output Options(V): 2.5; Vout Adj(Max)(V): 2.5